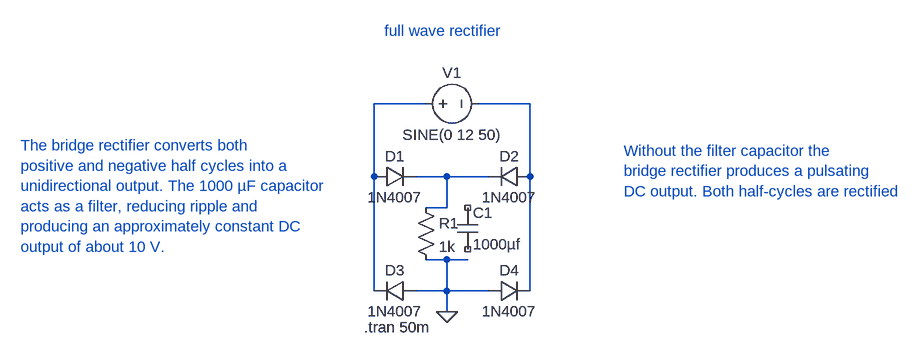
[diagram p0: schematic full wave rectifier.asc]
full wave rectifier.asc, the LTspice schematic file:
Version 4.1
SHEET 1 980 680
WIRE 208 -64 128 -64
WIRE 368 -64 288 -64
WIRE 128 48 128 -64
WIRE 240 48 192 48
WIRE 304 48 240 48
WIRE 368 48 368 -64
WIRE 240 96 240 48
WIRE 240 96 208 96
WIRE 240 176 208 176
WIRE 272 176 240 176
WIRE 128 224 128 48
WIRE 240 224 240 176
WIRE 240 224 192 224
WIRE 304 224 240 224
WIRE 368 224 368 48
WIRE 240 256 240 224
FLAG 240 256 0
SYMBOL diode 128 64 R270
WINDOW 0 32 32 VTop 2
WINDOW 3 0 32 VBottom 2
SYMATTR InstName D1
SYMATTR Value 1N4007
SYMBOL diode 368 32 R90
WINDOW 0 0 32 VBottom 2
WINDOW 3 32 32 VTop 2
SYMATTR InstName D2
SYMATTR Value 1N4007
SYMBOL diode 192 208 R90
WINDOW 0 0 32 VBottom 2
WINDOW 3 32 32 VTop 2
SYMATTR InstName D3
SYMATTR Value 1N4007
SYMBOL diode 304 240 R270
WINDOW 0 32 32 VTop 2
WINDOW 3 0 32 VBottom 2
SYMATTR InstName D4
SYMATTR Value 1N4007
SYMBOL res 192 80 R0
SYMATTR InstName R1
SYMATTR Value 1k
SYMBOL cap 256 96 R0
SYMATTR InstName C1
SYMATTR Value 1000µf
SYMBOL voltage 192 -64 R270
WINDOW 0 32 56 VTop 2
WINDOW 3 -32 56 VBottom 2
WINDOW 123 0 0 Left 0
WINDOW 39 0 0 Left 0
SYMATTR InstName V1
SYMATTR Value SINE(0 12 50)
TEXT 112 280 Left 2 !.tran 50m
TEXT 144 -176 Left 2 ;full wave rectifier
TEXT -416 0 Left 2 ;The bridge rectifier converts both \npositive and negative half cycles into a \nunidirectional output. The 1000 µF capacitor\nacts as a filter, reducing ripple and\nproducing an approximately constant DC \noutput of about 10 V.
TEXT 512 8 Left 2 ;Without the filter capacitor the \nbridge rectifier produces a pulsating \nDC output. Both half-cycles are rectified

The netlist it stands for:
* full wave rectifier.asc
D1 N001 N003 1N4007
D2 N002 N003 1N4007
D3 0 N001 1N4007
D4 0 N002 1N4007
R1 N003 0 1k
C1 NC_01 NC_02 1000µf
V1 N001 N002 SINE(0 12 50)
.model D D
.lib standard.dio
.tran 50m
* full wave rectifier
* The bridge rectifier converts both
* positive and negative half cycles into a
* unidirectional output. The 1000 µF capacitor
* acts as a filter, reducing ripple and
* producing an approximately constant DC
* output of about 10 V.
* Without the filter capacitor the
* bridge rectifier produces a pulsating
* DC output. Both half-cycles are rectified
.backanno
.end